# Altium project 方波产生器.PrjPCB
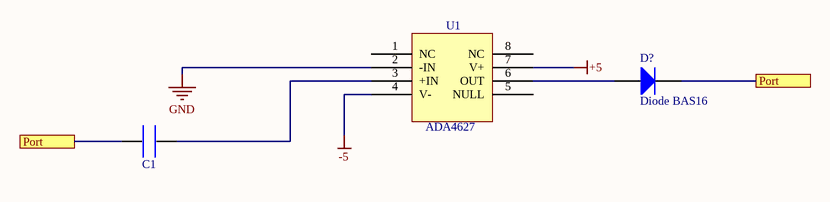
[diagram p0: 方波产生器.SchDoc]
1 sheet, 3 parts. Net scope: flat (ports and power ports of the same name join across sheets).
Board file: 方波产生器.PcbDoc

## Sheet 方波产生器.SchDoc
size A4

### Parts
C1  电容  (value not drawn)
D?  Diode BAS16  [SOT-23_N]
U1  ADA4627

### Ports
Port

### Nets
+5: U1.7(V+)
-5: U1.4(V-)
GND: U1.2(-IN)
NetC1_12: C1.12 D?.3(K) ; port Port
NetC1_13: C1.13 U1.3(+IN)
NetD?_1: D?.1(A) U1.6(OUT)

Not connected (* = marked no-connect by the designer): U1 1(NC) 5(NULL) 8(NC)

### Library data of the parts
D? = Diode BAS16: Silicon Switching Diode for High-Speed Switching; Note: Pin 2 is not connected and not drawn.; Published: 21-Mar-2003; LatestRevisionDate: 29-May-2009; LatestRevisionNote: IPC-7351 Footprint Added.; DatasheetVersion: Oct-1999; PackageVersion: Sep-2001; PackageReference: SOT-23; Publisher: Altium Limited; PackageDescription: 3-Pin SOT-23 Package 0.95 mm Pitch, 2.5 mm Lead Span; ComponentLink1Description: Manufacturer Link; ComponentLink1URL: http://www.infineon.com/; ComponentLink2Description: Datasheet; ComponentLink2URL: http://www.infineon.com/upload/Document/cmc_upload/documents/012/5331/bas16series.pdf
U1 = ADA4627: ADA4627运算放大器